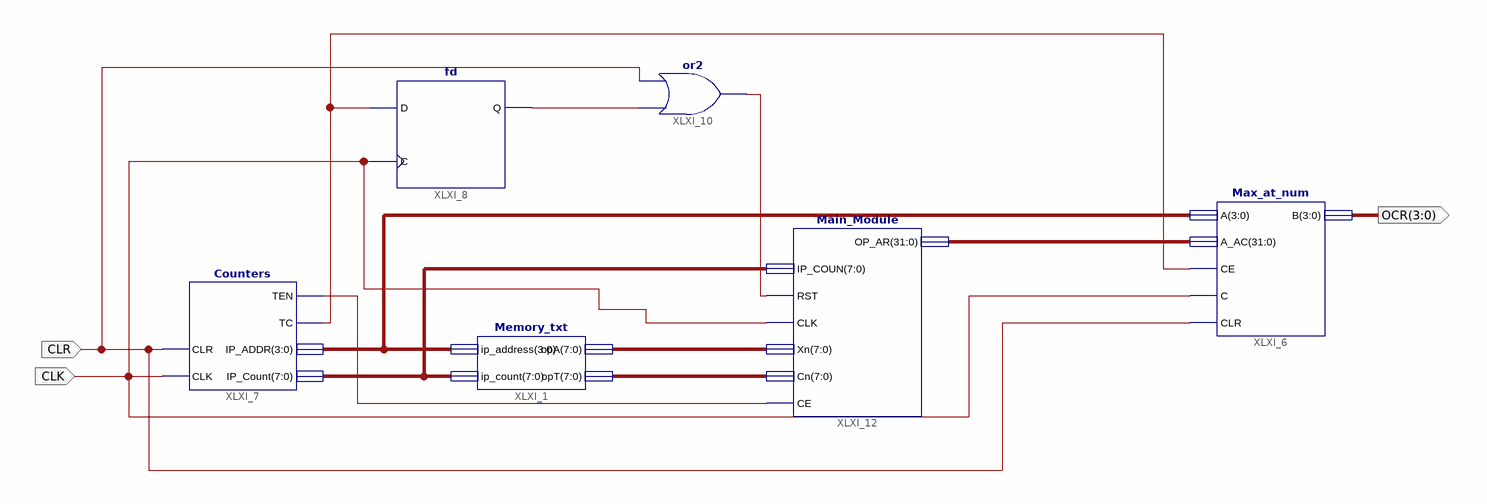
[diagram p0: schematic sheet 1]
// Xilinx ISE schematic Combing_Alpha.sch (spartan3e) as structural Verilog: 6 symbols, 3 ports
module Combing_Alpha (
  input  CLK,
  input  CLR,
  output [3:0] OCR
);

  wire TC, TEN, XLXN_69, XLXN_78;
  wire [3:0] IP_ADDR;
  wire [7:0] Cn, IP_CNT, Xn;
  wire [31:0] OPAR;

  Memory_txt XLXI_1 (.ip_address(IP_ADDR), .ip_count(IP_CNT), .opA(Xn), .opT(Cn));
  Max_at_num XLXI_6 (.A(IP_ADDR), .CE(TC), .C(CLK), .CLR(CLR), .A_AC(OPAR), .B(OCR));
  Counters XLXI_7 (.CLK(CLK), .CLR(CLR), .TC(TC), .IP_Count(IP_CNT), .IP_ADDR(IP_ADDR), .TEN(TEN));
  fd XLXI_8 (.C(CLK), .D(TC), .Q(XLXN_78));
  or XLXI_10 (XLXN_69, XLXN_78, CLR);
  Main_Module XLXI_12 (.IP_COUN(IP_CNT), .RST(XLXN_69), .CLK(CLK), .Xn(Xn), .Cn(Cn), .CE(TEN), .OP_AR(OPAR));
endmodule
